# EAGLE design Version 2.0 (EAGLE 9.6.2)
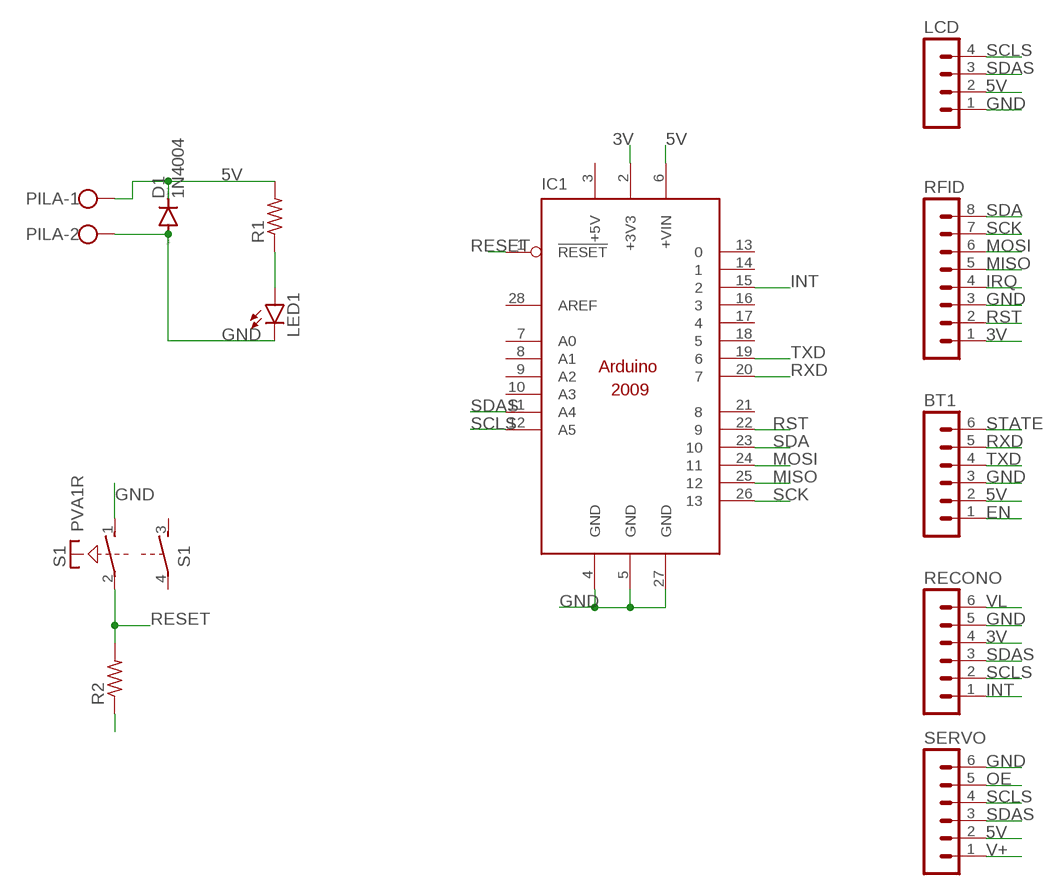
[diagram p0: schematic, sheet 1]

## Parts
BT1  MA06-1  [MA06-1]
D1  1N4004  [DO41-10]
IC1  ARDUINO2009_10  [ARDUINO2009]
LCD  MA04-1  [MA04-1]
LED1  LED3MM  [LED3MM]
PILA  W237-102  [W237-102]
R1  R-US_0204/7  [0204/7]
R2  R-US_0204/7  [0204/7]
RECONO  MA06-1  [MA06-1]
RFID  MA08-1  [MA08-1]
S1  PVA1R  [PVA1R]
SERVO  MA06-1  [MA06-1]

## Nets
3V: IC1.2(+3V3) RECONO.4 RFID.1
5V: BT1.2 D1.C IC1.6(+VIN) LCD.2 PILA.1 R1.2 R2.1 SERVO.2
EN: BT1.1
GND: BT1.3 D1.A IC1.4(GND) IC1.5(GND) IC1.27(GND) LCD.1 LED1.K(C) PILA.2 RECONO.5 RFID.3 S1.1(1:S) SERVO.6
INT: IC1.15 RECONO.1
IRQ: RFID.4
MISO: IC1.25 RFID.5
MOSI: IC1.24 RFID.6
N$2: LED1.A R1.1
OE: SERVO.5
RESET: IC1.1(!RESET) R2.2 S1.2(1:P)
RST: IC1.22 RFID.2
RXD: BT1.5 IC1.20
SCK: IC1.26 RFID.7
SCLS: IC1.12(A5) LCD.4 RECONO.2 SERVO.4
SDA: IC1.23 RFID.8
SDAS: IC1.11(A4) LCD.3 RECONO.3 SERVO.3
STATE: BT1.6
TXD: BT1.4 IC1.19
V+: SERVO.1
VL: RECONO.6
Unconnected: IC1.7(A0) IC1.8(A1) IC1.9(A2) IC1.10(A3) IC1.13 IC1.14 IC1.16 IC1.17 IC1.18 IC1.21 IC1.28(AREF) S1.3(2:S) S1.4(2:P)

## Power pins joined to a net without a drawn wire
+5V: IC1.3(+5V)

## Library data of the parts
BT1 RECONO SERVO = con-lstb:MA06-1: PIN HEADER; OC_FARNELL: unknown; OC_NEWARK: unknown
D1 = diode:1N4004: DIODE general purpose rectifier, 1 A
IC1 = arduino:ARDUINO2009_1: The Arduino Duemilanove ("2009") is a microcontroller board based on the ATmega168 or ATmega328. - 14 digital input/output pins (of which 6 can be used as PWM outputs) - 6 analog inputs, a 16 MHz crystal oscillator - USB connection - power jack - ISP header - reset button It contains everything needed to support the microcontroller; simply connect it to a computer with a USB cable or power it with a AC-to-DC adapter or battery to get started http://arduino.cc/en/Main/ArduinoBoardDuemilanove
LCD = con-lstb:MA04-1: PIN HEADER; OC_FARNELL: unknown; OC_NEWARK: unknown
LED1 = led:LED: LED OSRAM: - CHIPLED LG R971, LG N971, LY N971, LG Q971, LY Q971, LO R971, LY R971 LH N974, LH R974 LS Q976, LO Q976, LY Q976 LO Q996 - Hyper CHIPLED LW Q18S LB Q993, LB Q99A, LB R99A - SideLED LS A670, LO A670, LY A670, LG A670, LP A670 LB A673, LV A673, LT A673, LW A673 LH A674 LY A675 LS A676, LA A676, LO A676, LY A676, LW A676 LS A679, LY A679, LG A679 - Hyper Micro SIDELED® LS Y876, LA Y876, LO Y876, LY Y876 LT Y87S - SmartLED LW L88C, LW L88S LB L89C, LB L89S, LG L890 LS L89K, LO L89K, LY L89K LS L896, LA L896, LO L896, LY L896 - TOPLED LS T670, LO T670, LY T670, LG T670, LP T670 LSG T670, LSP T670, LSY T670, LOP T670, LYG T670 LG T671, LOG T671, LSG T671 LB T673, LV T673, LT T673, LW T673 LH T674 LS T676, LA T676, LO T676, LY T676, LB T676, LH T676, LSB T676, LW T676 LB T67C, LV T67C, LT T67C, LS T67K, LO T67K, LY T67K, LW E67C LS E67B, LA E67B, LO E67B, LY E67B, LB E67C, LV E67C, LT E67C LW T67C LS T679, LY T679, LG T679 LS T770, LO T770, LY T770, LG T770, LP T770 LB T773, LV T773, LT T773, LW T773 LH T774 LS E675, LA E675, LY E675, LS T675 LS T776, LA T776, LO T776, LY T776, LB T776 LHGB T686 LT T68C, LB T68C - Hyper Mini TOPLED® LB M676 - Mini TOPLED Santana® LG M470 LS M47K, LO M47K, LY M47K Source: http://www.osram.convergy.de LUXEON: - LUMILED® LXK2-PW12-R00, LXK2-PW12-S00, LXK2-PW14-U00, LXK2-PW14-V00 LXK2-PM12-R00, LXK2-PM12-S00, LXK2-PM14-U00 LXK2-PE12-Q00, LXK2-PE12-R00, LXK2-PE12-S00, LXK2-PE14-T00, LXK2-PE14-U00 LXK2-PB12-K00, LXK2-PB12-L00, LXK2-PB12-M00, LXK2-PB14-N00, LXK2-PB14-P00, LXK2-PB14-Q00 LXK2-PR12-L00, LXK2-PR12-M00, LXK2-PR14-Q00, LXK2-PR14-R00 LXK2-PD12-Q00, LXK2-PD12-R00, LXK2-PD12-S00 LXK2-PH12-R00, LXK2-PH12-S00 LXK2-PL12-P00, LXK2-PL12-Q00, LXK2-PL12-R00 Source: www.luxeon.com KINGBRIGHT: KA-3528ASYC Source: www.kingbright.com
PILA = con-wago-500:W237-102: WAGO SCREW CLAMP; MPN: 237-102; OC_FARNELL: unknown; OC_NEWARK: 70K9898
R1 R2 = rcl:R-US_: RESISTOR, American symbol; SPICEPREFIX: R
RFID = con-lstb:MA08-1: PIN HEADER; OC_FARNELL: unknown; OC_NEWARK: unknown
S1 = switch-misc:PVA1R: ITT SWITCH

## Board
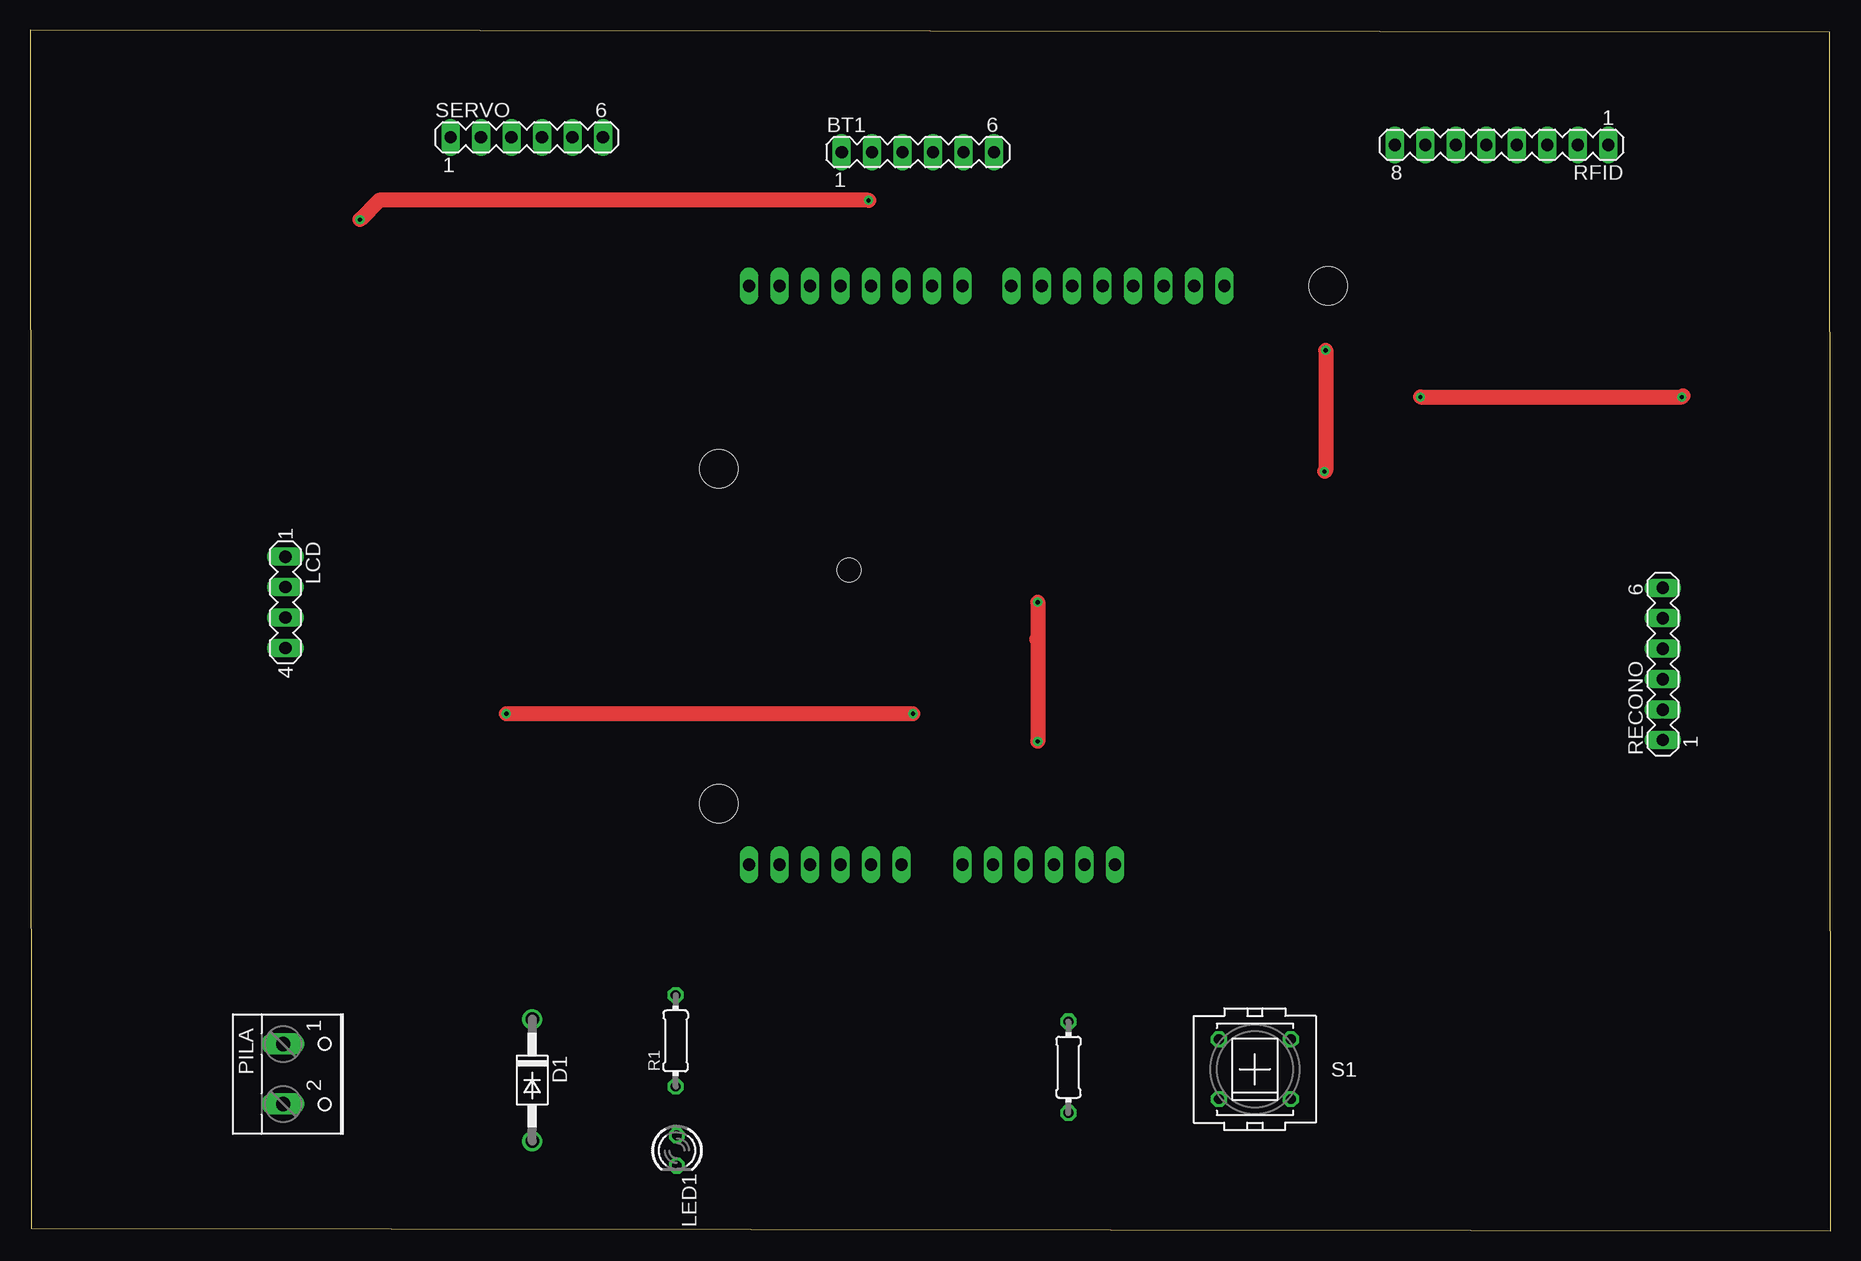
[diagram p1: board, top side]
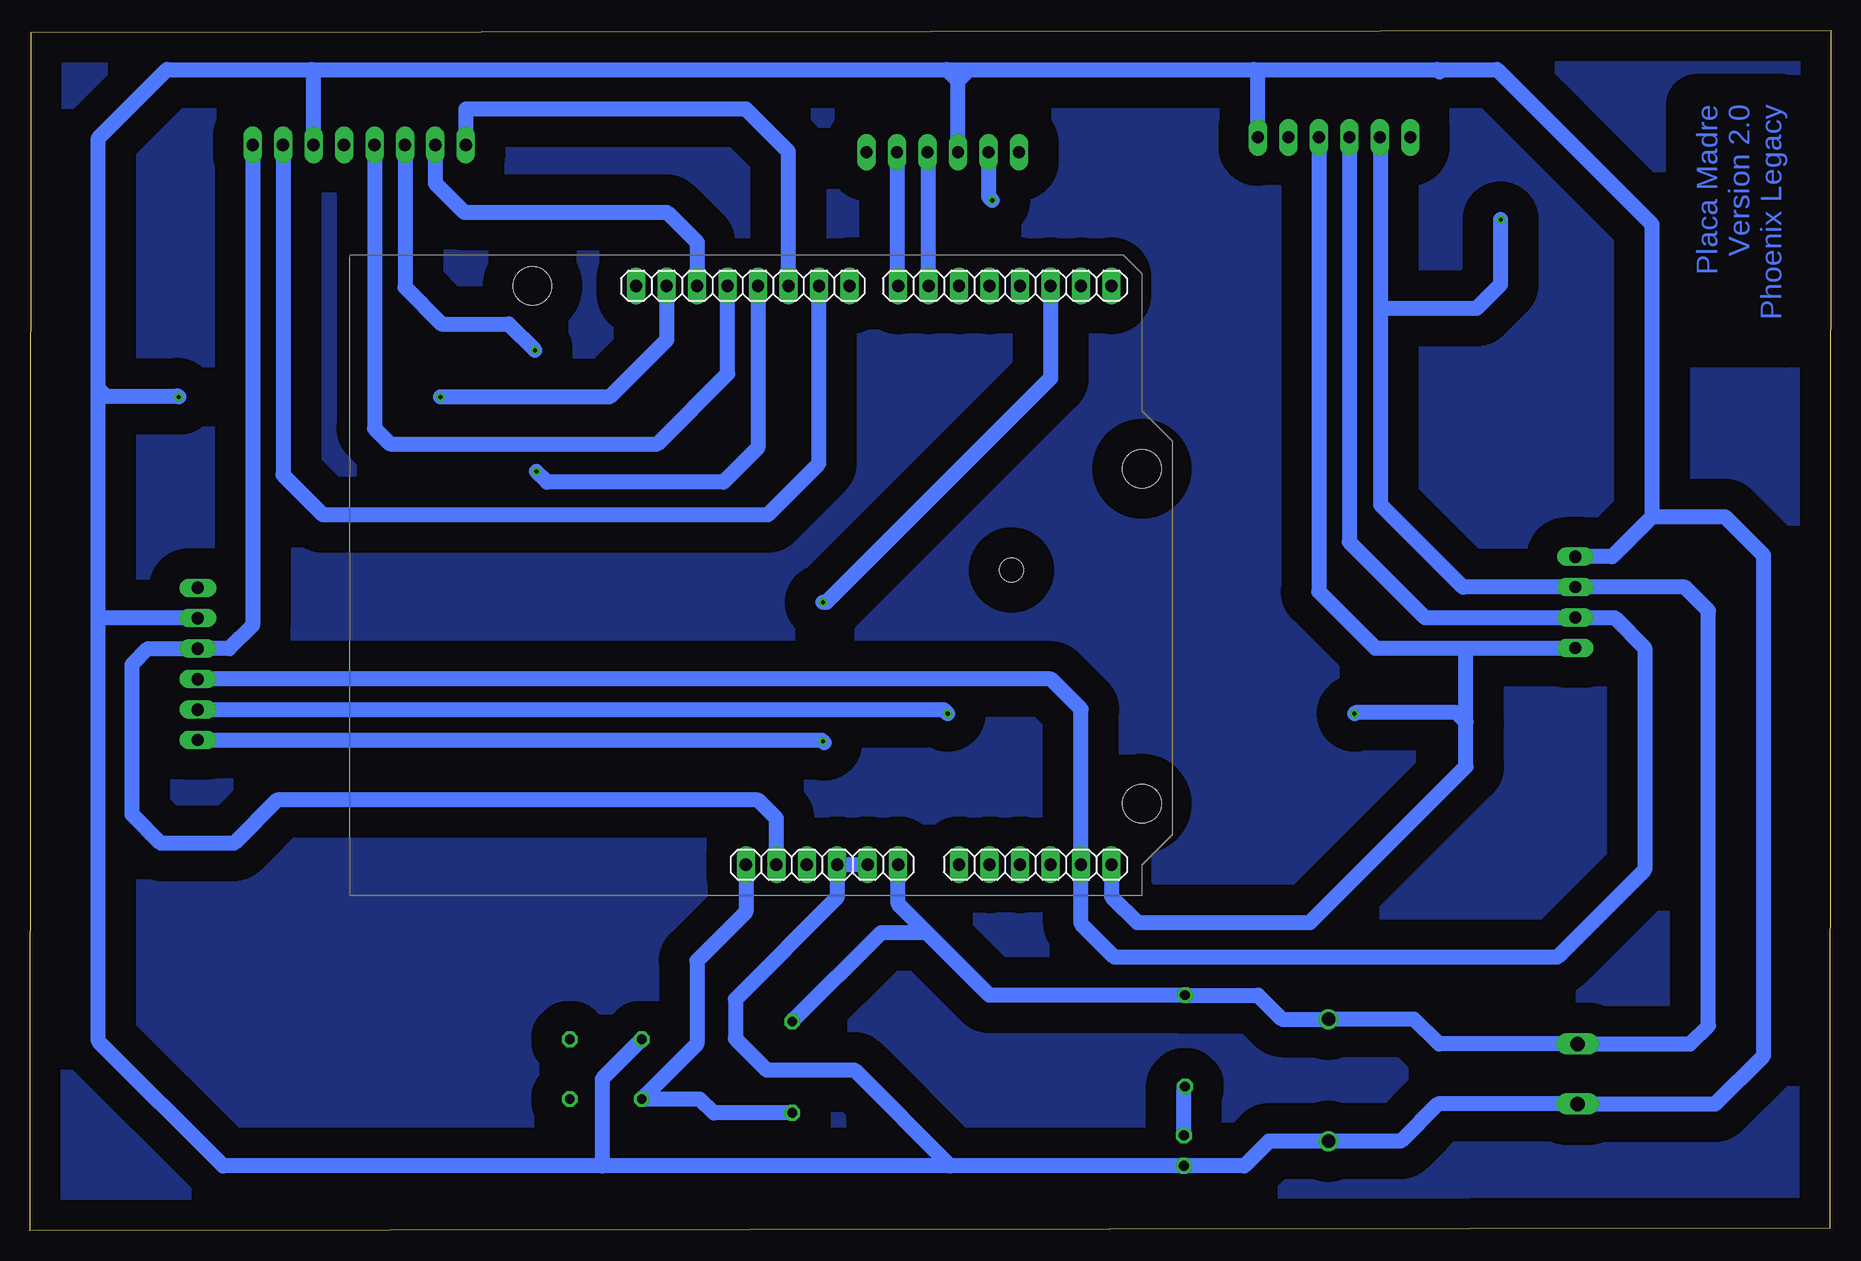
[diagram p2: board, bottom side, seen from below]

Size 150.1 x 100.1 mm. Coordinates in mm from the lower left corner, seen from the top.
Outline: 0.1,0.2 150.1,0 150,99.9 0,100.1 0.1,0.2
Copper layers (1*16): Top 0.035mm / dielectric 1.5mm / Bottom 0.035mm
Design rules "default": minimum track width 6mil, minimum drill 0.35mm, track to track 6mil, track to pad 6mil, pad to pad 6mil, via to via 6mil, smd to smd 6mil, copper to edge 40mil, drill to drill 6mil, minimum pad ring 10mil, minimum via ring 8mil, stop-mask expansion 4mil, vias tented up to drill 0mil, thermal gap 10mil

### Footprints (pad centres in the part's own frame; a part is rotated, then mirrored left to right if it is on the bottom)
MA06-1 = drill 1.016 long: 1 -6.35,0; 2 -3.81,0; 3 -1.27,0; 4 1.27,0; 5 3.81,0; 6 6.35,0
DO41-10 = drill 1.118: A 5.08,0; C -5.08,0
ARDUINO2009 = drill 1.016 long: 1 33.02,2.54; 2 35.56,2.54; 3 38.1,2.54; 4 40.64,2.54; 5 43.18,2.54; 6 45.72,2.54; 7 50.8,2.54; 8 53.34,2.54; 9 55.88,2.54; 10 58.42,2.54; 11 60.96,2.54; 12 63.5,2.54; 13 63.5,50.8; 14 60.96,50.8; 15 58.42,50.8; 16 55.88,50.8; 17 53.34,50.8; 18 50.8,50.8; 19 48.26,50.8; 20 45.72,50.8; 21 41.656,50.8; 22 39.116,50.8; 23 36.576,50.8; 24 34.036,50.8; 25 31.496,50.8; 26 28.956,50.8; 27 26.416,50.8; 28 23.876,50.8 | hole 3.2: 15.24,50.8; 66.04,35.56; 66.04,7.62 | hole 2: 55.17,27.114
MA04-1 = drill 1.016 long: 1 -3.81,0; 2 -1.27,0; 3 1.27,0; 4 3.81,0
LED3MM = drill 0.813 octagon: A -1.27,0; K 1.27,0
W237-102 = drill 1.194 long: 1 -2.5,-1.27; 2 2.5,-1.27
0204/7 = drill 0.813 octagon: 1 -3.81,0; 2 3.81,0
MA08-1 = drill 1.016 long: 1 -8.89,0; 2 -6.35,0; 3 -3.81,0; 4 -1.27,0; 5 1.27,0; 6 3.81,0; 7 6.35,0; 8 8.89,0
PVA1R = drill 0.813 octagon: 1 -2.997,2.489; 2 -2.997,-2.489; 3 2.997,2.489; 4 2.997,-2.489

### Placement (x,y rotation side)
BT1  74.01,89.92 0 top
D1  41.86,12.55 270 top
IC1  123.45,27.97 0 bottom
LCD  21.29,52.38 270 top
LED1  53.92,6.68 270 top
PILA  22.37,13.06 270 top
R1  53.82,15.83 90 top
R2  86.56,13.63 270 top
RECONO  136.11,47.25 90 top
RFID  122.66,90.52 180 top
S1  102.1,13.46 0 top
SERVO  41.4,91.15 0 top

### Tracks (layer width: path | path; a pad name or v marks a point on that pad's centre or on a via)
3V
  Bottom 1.27: RFID.1 131.55,50.45 133.48,48.52 RECONO.4 140.28,48.52 141.6,47.2 141.6,34.7 139.2,32.3 133.1,32.3 129.5,35.9 89.4,35.9 87.89,34.39 IC1.2
5V  (via drill 0.35)
  Top 1.27: v69.9,85.9 29.1,85.9 v27.5,84.3
  Bottom 1.27: IC1.6 77.73,27.23 75.34,24.84 | 75.34,24.84 70.14,19.64 R1.2 47.74,19.64 45.73,17.63 D1.C 34.73,17.63 32.66,15.56 PILA.1 11.74,15.56 10.2,17.1 10.2,51.7 12.15,53.65 LCD.2 30.65,53.65 37.5,60.5 37.5,76.9 | 75.34,24.84 79.16,24.84 R2.1 | SERVO.2 37.5,91.06 37.5,76.9 | 37.5,76.9 29.5,76.9 27.5,78.9 v27.5,84.3 | BT1.2 70.2,86.2 v69.9,85.9
GND  (via drill 0.35)
  Top 1.27: v115.9,69.5 v137.7,69.5 137.8,69.6
  Bottom 1.27: IC1.5 IC1.4 82.81,27.79 91.3,19.3 91.3,16 88.7,13.4 81.39,13.4 73.4,5.41 | 73.4,5.41 LED1.K 48.89,5.41 46.83,7.47 D1.A 35.83,7.47 32.74,10.56 PILA.2 9.64,10.56 5.6,14.6 5.6,56.3 8.8,59.5 14.9,59.5 | 73.4,5.41 102.4,5.41 | S1.1 102.4,12.65 102.4,5.41 | BT1.3 72.74,95.86 | 72.74,95.86 72.2,96.4 | 144.4,51.1 144.4,15.8 134.01,5.41 102.4,5.41 | 144.4,51.1 144.4,70.2 | 144.4,70.2 144.4,91.1 138.7,96.8 126.6,96.8 | 72.74,95.86 73.68,96.8 | 126.6,96.8 73.68,96.8 | RECONO.5 144.36,51.06 144.4,51.1 | RFID.3 126.47,96.67 126.6,96.8 | 73.68,96.8 48.1,96.8 | 48.1,96.8 32.8,96.8 | 32.8,96.8 32.6,96.6 | SERVO.6 47.75,96.45 48.1,96.8 | 32.8,96.8 27.8,96.8 14.9,83.9 14.9,59.5 | LCD.1 18.21,56.19 14.9,59.5 | IC1.27 97.03,74.27 101.8,69.5 v115.9,69.5 | 144.4,70.2 143.8,69.6 137.8,69.6 v137.7,69.5
IMPRESION
  pour Bottom (isolate 2.54): 0.1,100.2 0.1,0.2 150.1,0.2 150.1,100.2
INT  (via drill 0.35)
  Top 1.27: 83.9,49.3 84,49.2 | 84,49.2 v84,40.8 | v84,52.4 84,49.2
  Bottom 1.27: RECONO.1 84.1,40.9 v84,40.8 83.9,40.7 | v84,52.4 83.7,52.4 65.03,71.07 IC1.15
MISO
  Bottom 1.27: RFID.5 121.39,66.89 120.1,65.6 97.8,65.6 91.95,71.45 IC1.25
MOSI  (via drill 0.35)
  Top 1.27: v108,73.4 108,63.4 v107.9,63.3
  Bottom 1.27: IC1.24 89.41,65.29 92.3,62.4 107,62.4 v107.9,63.3 | v108,73.4 110.2,75.6 115.8,75.6 118.85,78.65 RFID.6
N$2
  Bottom 1.27: LED1.A 53.92,11.92 R1.1
RESET
  Bottom 1.27: 97.53,10.97 S1.2 | S1.2 94.27,10.97 93.12,9.82 R2.2 | IC1.1 90.43,26.57 94.5,22.5 94.5,15.57 S1.2
RST
  Bottom 1.27: RFID.2 129.01,63.01 125.7,59.7 88.6,59.7 84.33,63.97 IC1.22
RXD
  Bottom 1.27: BT1.5 77.82,78.86 IC1.20
SCK
  Bottom 1.27: RFID.7 116.31,87.31 113.9,84.9 97,84.9 94.49,82.39 IC1.26
SCLS  (via drill 0.35)
  Top 1.27: v73.6,43.1 v39.7,43.1
  Bottom 1.27: SERVO.4 42.67,53.27 37.97,48.57 30.4,48.57 | 30.4,48.57 LCD.4 | IC1.12 59.95,27.85 57.8,25.7 43.4,25.7 30.4,38.7 30.4,42.4 | 30.4,42.4 30.4,48.57 | RECONO.2 73.94,43.44 v73.6,43.1 | 30.4,42.4 31.2,43.2 39.6,43.2 v39.7,43.1
SDA
  Bottom 1.27: IC1.23 86.87,89.97 90.4,93.5 113.77,93.5 RFID.8
SDAS
  Bottom 1.27: SERVO.3 40.13,57.43 33.81,51.11 LCD.3 18.01,51.11 15.5,48.6 15.5,30.1 22.8,22.8 59.7,22.8 62.49,25.59 IC1.11 62.49,43.49 64.98,45.98 RECONO.3
TXD
  Bottom 1.27: IC1.19 75.19,89.83 BT1.4

### Text on the board
Bottom: Placa Madre / Version 2.0 / Phoenix Legacy